# EAGLE design NAV_Doska_1 (EAGLE 7.2.0)
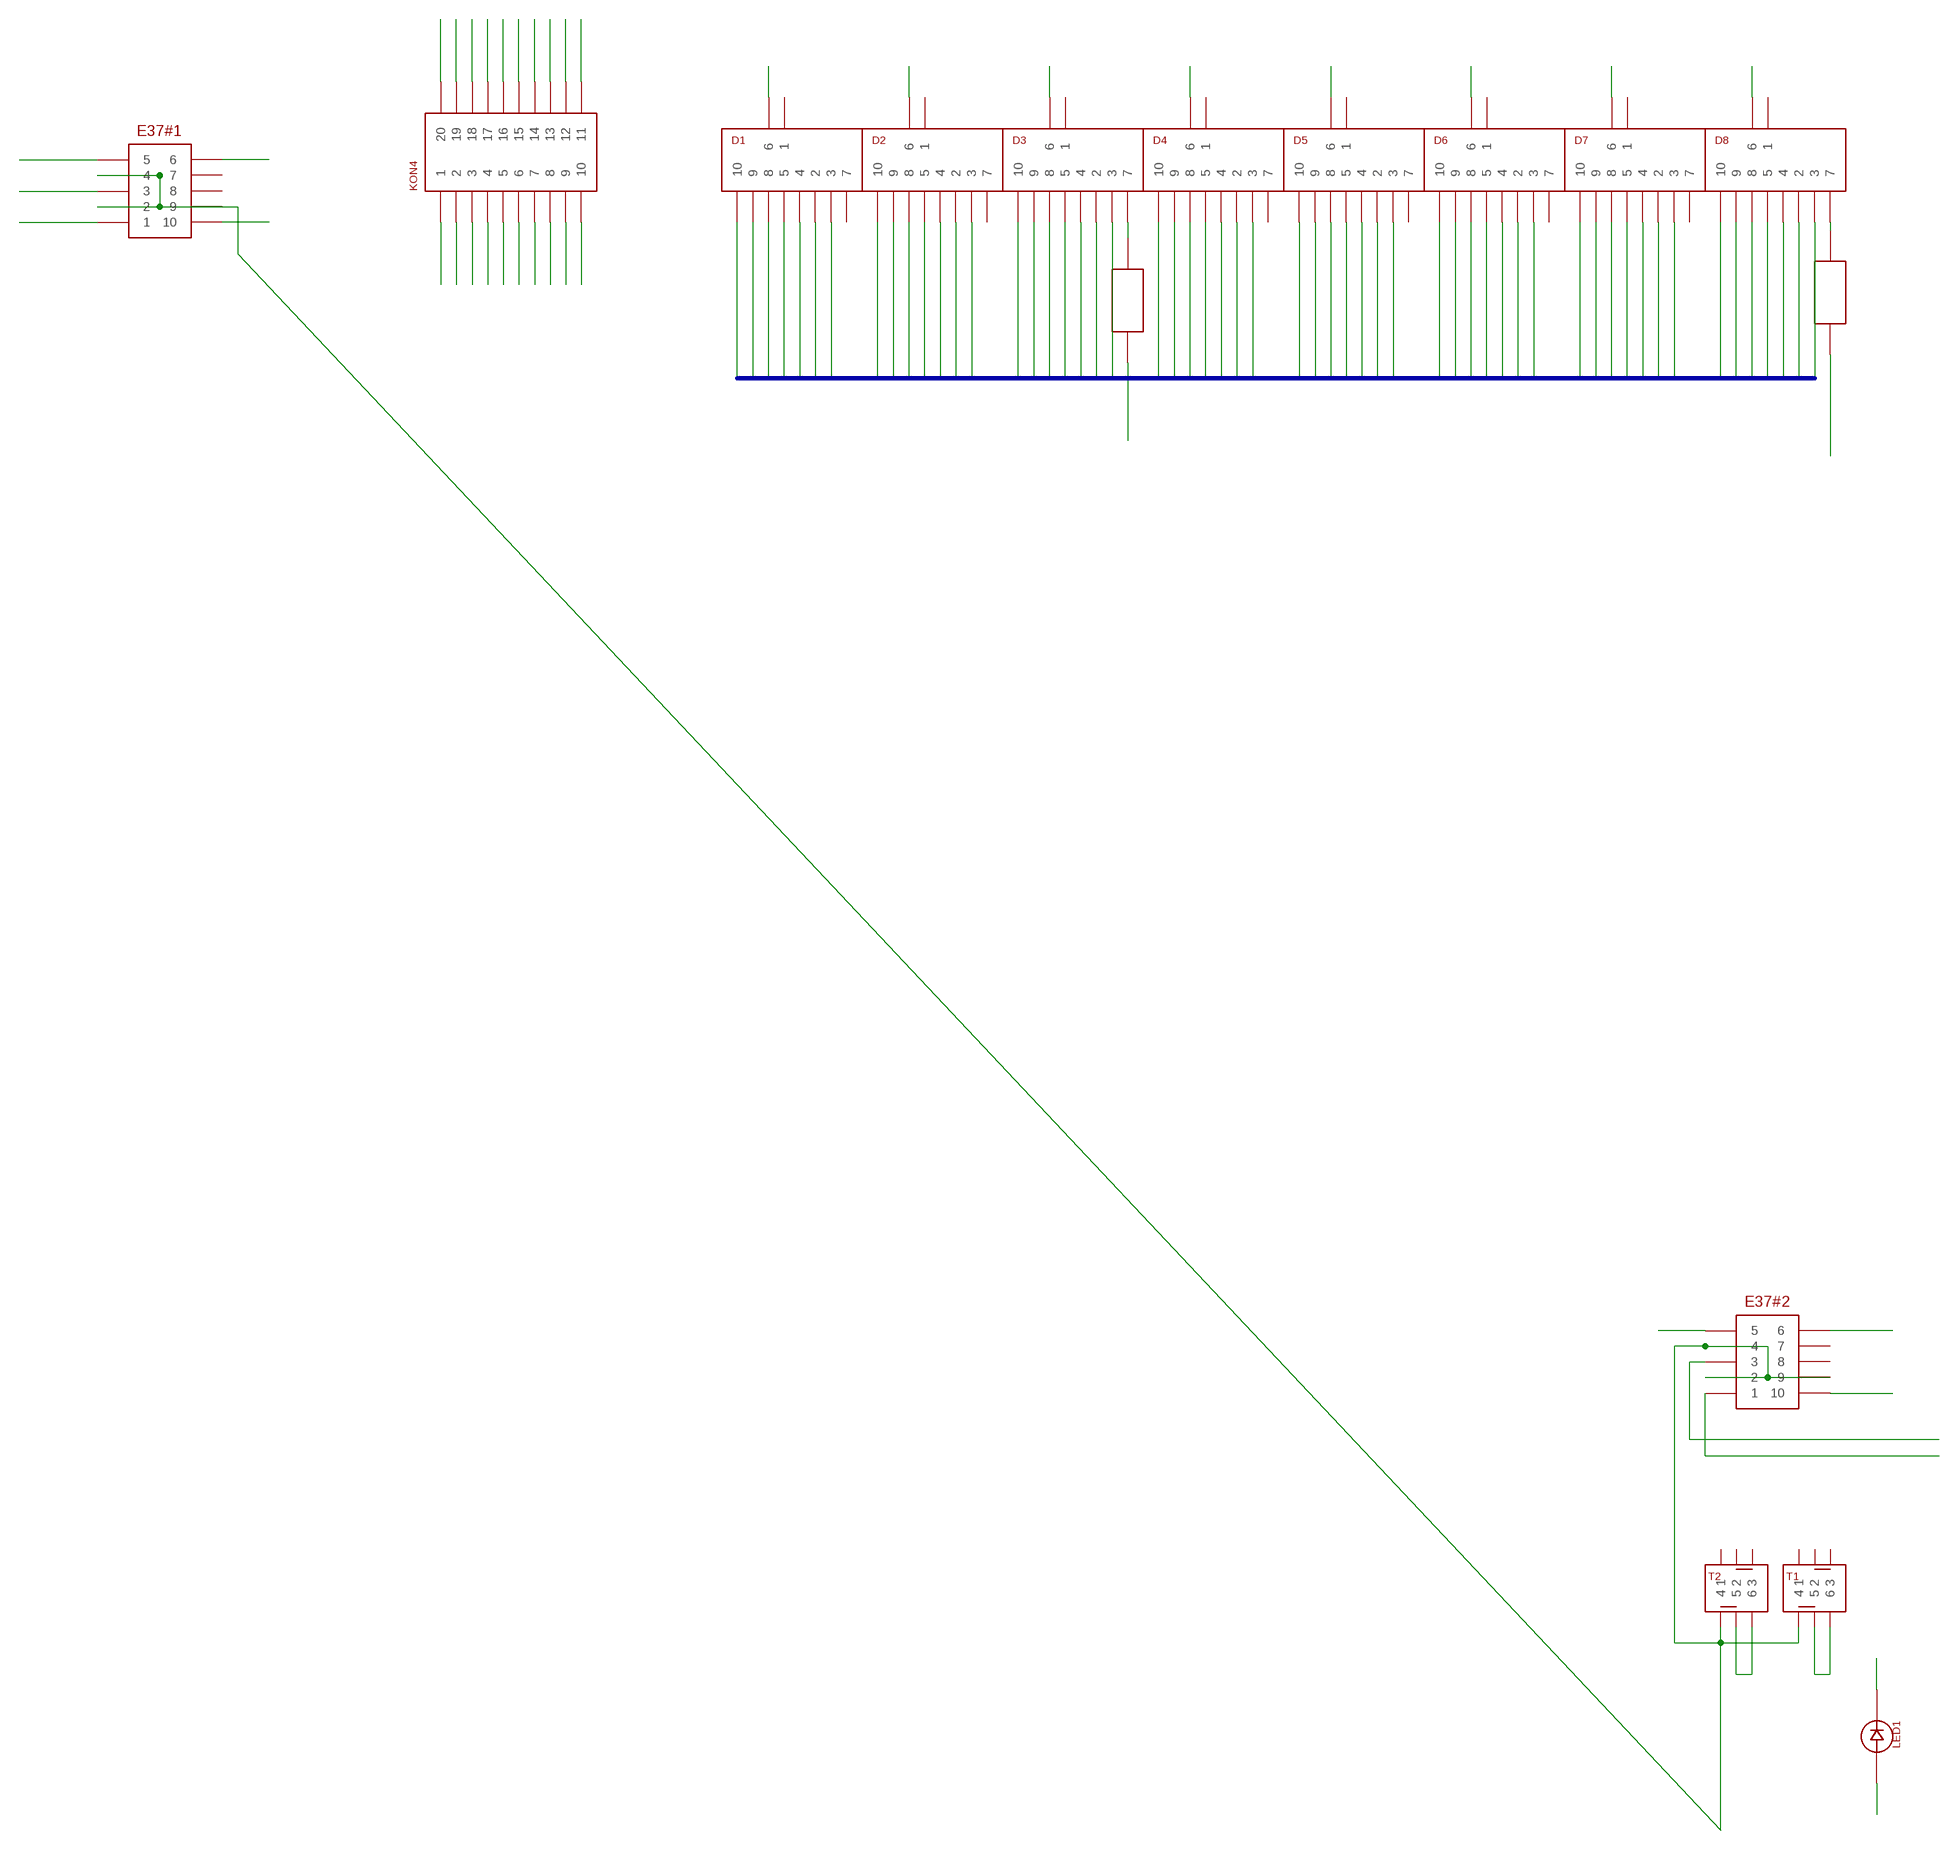
[diagram p0: schematic, sheet 1, part 1 of 2]
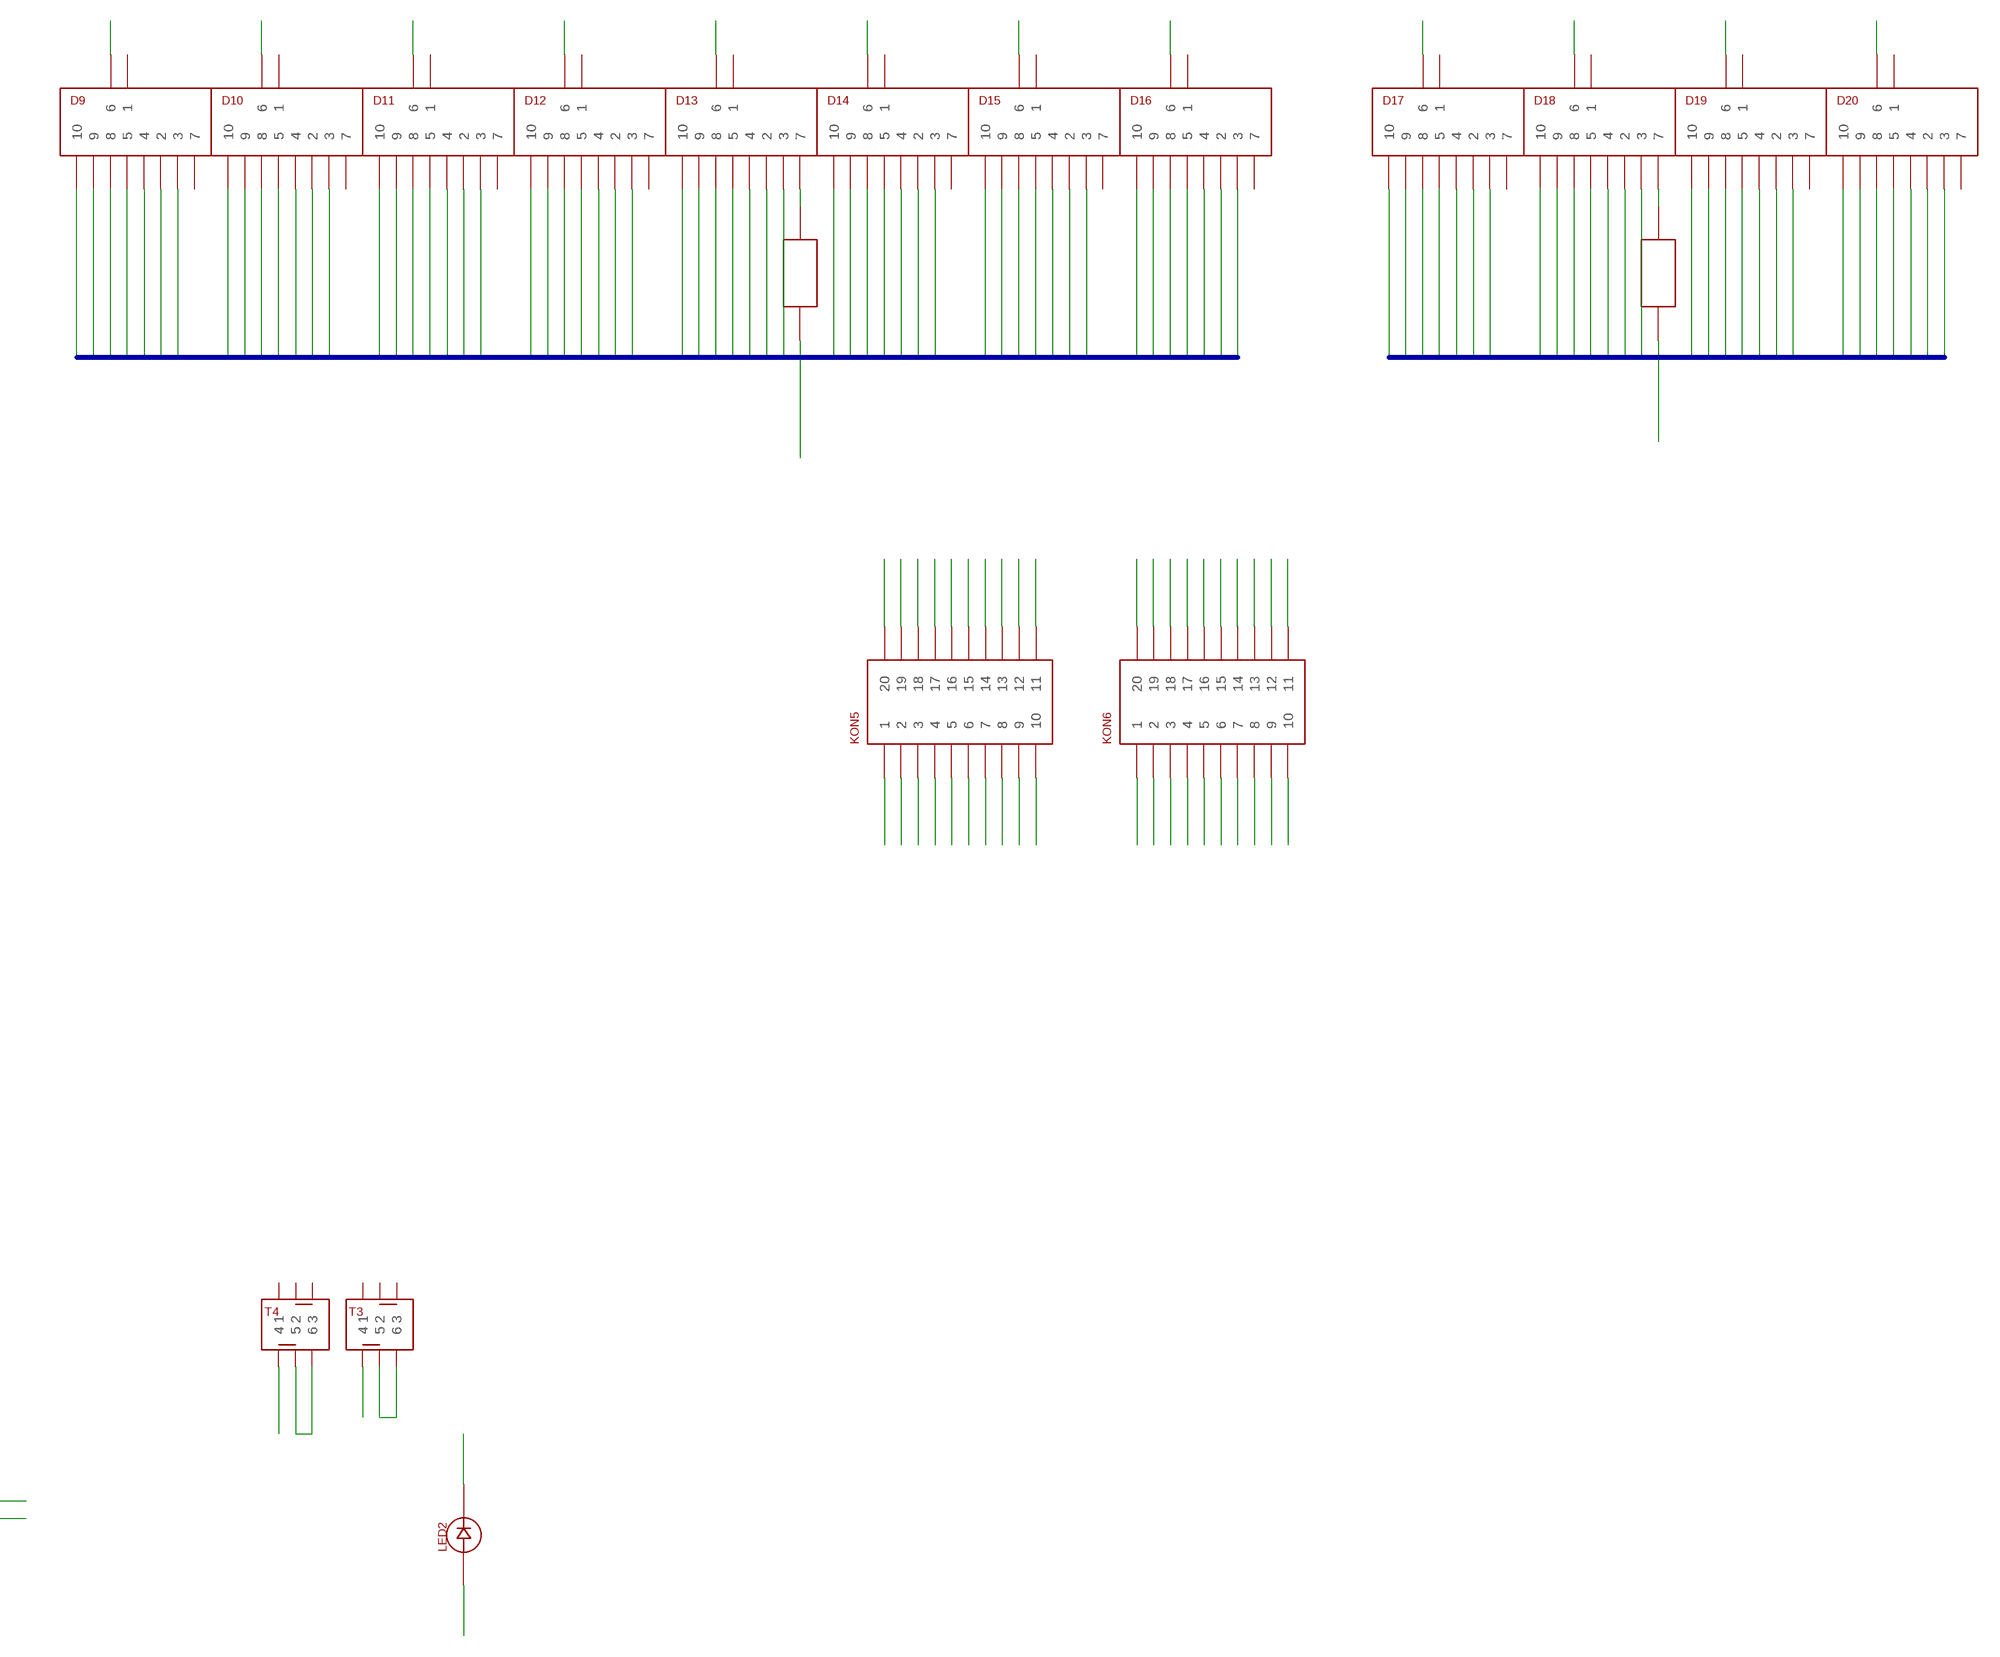
[diagram p1: schematic, sheet 1, part 2 of 2]

## Parts
D1  SA3611EWA  [SA3611EWA]
D2  SA3611EWA  [SA3611EWA]
D3  SA3611EWA  [SA3611EWA]
D4  SA3611EWA  [SA3611EWA]
D5  SA3611EWA  [SA3611EWA]
D6  SA3611EWA  [SA3611EWA]
D7  SA3611EWA  [SA3611EWA]
D8  SA3611EWA  [SA3611EWA]
D9  SA3611EWA  [SA3611EWA]
D10  SA3611EWA  [SA3611EWA]
D11  SA3611EWA  [SA3611EWA]
D12  SA3611EWA  [SA3611EWA]
D13  SA3611EWA  [SA3611EWA]
D14  SA3611EWA  [SA3611EWA]
D15  SA3611EWA  [SA3611EWA]
D16  SA3611EWA  [SA3611EWA]
D17  SA3611EWA  [SA3611EWA]
D18  SA3611EWA  [SA3611EWA]
D19  SA3611EWA  [SA3611EWA]
D20  SA3611EWA  [SA3611EWA]
E37#1  ELMA_E37  [ELMA_E37]
E37#2  ELMA_E37  [ELMA_E37]
KON4  LISTA_2X10  [LISTA_2X10]
KON5  LISTA_2X10  [LISTA_2X10]
KON6  LISTA_2X10  [LISTA_2X10]
LED1  LED_5MM  [LED_5MM]
LED2  LED_5MM  [LED_5MM]
T1  P1-0S  [P1-0S]
T2  P1-0S  [P1-0S]
T3  P1-0S  [P1-0S]
T4  P1-0S  [P1-0S]
U$1  REZISTOR  [REZISTOR]
U$2  REZISTOR  [REZISTOR]
U$3  REZISTOR  [REZISTOR]
U$4  REZISTOR  [REZISTOR]

## Nets
D1: D1.6 KON4.1
D2: D2.6 KON4.2
D3: D3.6 KON4.9
D4: D4.6 KON4.6
D5: D5.6 KON4.3
D6: D6.6 KON4.8
D7: D7.6 KON4.7
D8: D8.6 KON4.4
D9: D9.6 KON5.1
D10: D10.6 KON5.2
D11: D11.6 KON5.9
D12: D12.6 KON5.6
D13: D13.6 KON5.3
D14: D14.6 KON5.8
D15: D15.6 KON5.7
D16: D16.6 KON5.4
D17: D17.6 KON6.1
D18: D18.6 KON6.2
D19: D19.6 KON6.9
D20: D20.6 KON6.6
DRIVER1_SEG2: D1.2 D2.2 D3.2 D4.2 D5.2 D6.2 D7.2 D8.2 KON4.10
DRIVER1_SEG3: D1.3 D2.3 D3.3 D4.3 D5.3 D6.3 D7.3 D8.3 KON4.12
DRIVER1_SEG4: D1.4 D2.4 D3.4 D4.4 D5.4 D6.4 D7.4 D8.4 KON4.15
DRIVER1_SEG5: D1.5 D2.5 D3.5 D4.5 D5.5 D6.5 D7.5 D8.5 KON4.16
DRIVER1_SEG8: D1.8 D2.8 D3.8 D4.8 D5.8 D6.8 D7.8 D8.8 KON4.14
DRIVER1_SEG9: D1.9 D2.9 D3.9 D4.9 D5.9 D6.9 D7.9 D8.9 KON4.11
DRIVER1_SEG10: D1.10 D2.10 D3.10 D4.10 D5.10 D6.10 D7.10 D8.10 KON4.13
DRIVER2_SEG2: D9.2 D10.2 D11.2 D12.2 D13.2 D14.2 D15.2 D16.2 KON5.10
DRIVER2_SEG3: D9.3 D10.3 D11.3 D12.3 D13.3 D14.3 D15.3 D16.3 KON5.12
DRIVER2_SEG4: D9.4 D10.4 D11.4 D12.4 D13.4 D14.4 D15.4 D16.4 KON5.15
DRIVER2_SEG5: D9.5 D10.5 D11.5 D12.5 D13.5 D14.5 D15.5 D16.5 KON5.16
DRIVER2_SEG8: D9.8 D10.8 D11.8 D12.8 D13.8 D14.8 D15.8 D16.8 KON5.14
DRIVER2_SEG9: D9.9 D10.9 D11.9 D12.9 D13.9 D14.9 D15.9 D16.9 KON5.11
DRIVER2_SEG10: D9.10 D10.10 D11.10 D12.10 D13.10 D14.10 D15.10 D16.10 KON5.13
DRIVER3_SEG2: D17.2 D18.2 D19.2 D20.2 KON6.10
DRIVER3_SEG3: D17.3 D18.3 D19.3 D20.3 KON6.12
DRIVER3_SEG4: D17.4 D18.4 D19.4 D20.4 KON6.15
DRIVER3_SEG5: D17.5 D18.5 D19.5 D20.5 KON6.16 LED1.P$2 LED2.P$2
DRIVER3_SEG8: D17.8 D18.8 D19.8 D20.8 KON6.14
DRIVER3_SEG9: D17.9 D18.9 D19.9 D20.9 KON6.11
DRIVER3_SEG10: D17.10 D18.10 D19.10 D20.10 KON6.13
E37#1_1: E37#1.1 KON4.17
E37#1_3: E37#1.3 KON4.18
E37#1_5: E37#1.5 KON4.20
E37#1_6: E37#1.6 KON4.19
E37#1_10: E37#1.10 KON4.5
E37#2_1: E37#2.1 KON6.17
E37#2_3: E37#2.3 KON6.18
E37#2_5: E37#2.5 KON6.20
E37#2_6: E37#2.6 KON6.19
E37#2_10: E37#2.10 KON6.5
GND: E37#1.2 E37#1.4 E37#1.9 E37#2.2 E37#2.4 E37#2.9 KON5.5 T1.4 T2.4 T3.5 T3.6 T4.5 T4.6 U$1.P$1 U$2.P$1 U$3.P$1 U$4.P$1
LED1: KON6.3 LED1.P$1
LED2: KON6.8 LED2.P$1
N$2: D3.7 U$4.P$2
N$3: D18.7 U$2.P$2
N$4: D13.7 U$1.P$2
N$5: D8.7 U$3.P$2
N$33: KON6.4
N$42: KON6.7
T1: KON5.20 T1.5 T1.6
T2: KON5.19 T2.5 T2.6
T3: KON5.18 T3.4
T4: KON5.17 T4.4
Unconnected: D1.1 D1.7 D2.1 D2.7 D3.1 D4.1 D4.7 D5.1 D5.7 D6.1 D6.7 D7.1 D7.7 D8.1 D9.1 D9.7 D10.1 D10.7 D11.1 D11.7 D12.1 D12.7 D13.1 D14.1 D14.7 D15.1 D15.7 D16.1 D16.7 D17.1 D17.7 D18.1 D19.1 D19.7 D20.1 D20.7 E37#1.7 E37#1.8 E37#2.7 E37#2.8 T1.1 T1.2 T1.3 T2.1 T2.2 T2.3 T3.1 T3.2 T3.3 T4.1 T4.2 T4.3

## Buses
B$1
B$2
B$3

## Library data of the parts
D1-D20 = RadioStack_v2:SA3611EWA
E37#1 E37#2 = RadioStack_v2:ELMA_E37
KON4-KON6 = RadioStack_v2:LISTA_2X10
LED1 LED2 = RadioStack_v2:LED_5MM
T1-T4 = RadioStack_v2:P1-0S
U$1-U$4 = RadioStack_v2:REZISTOR

## Board
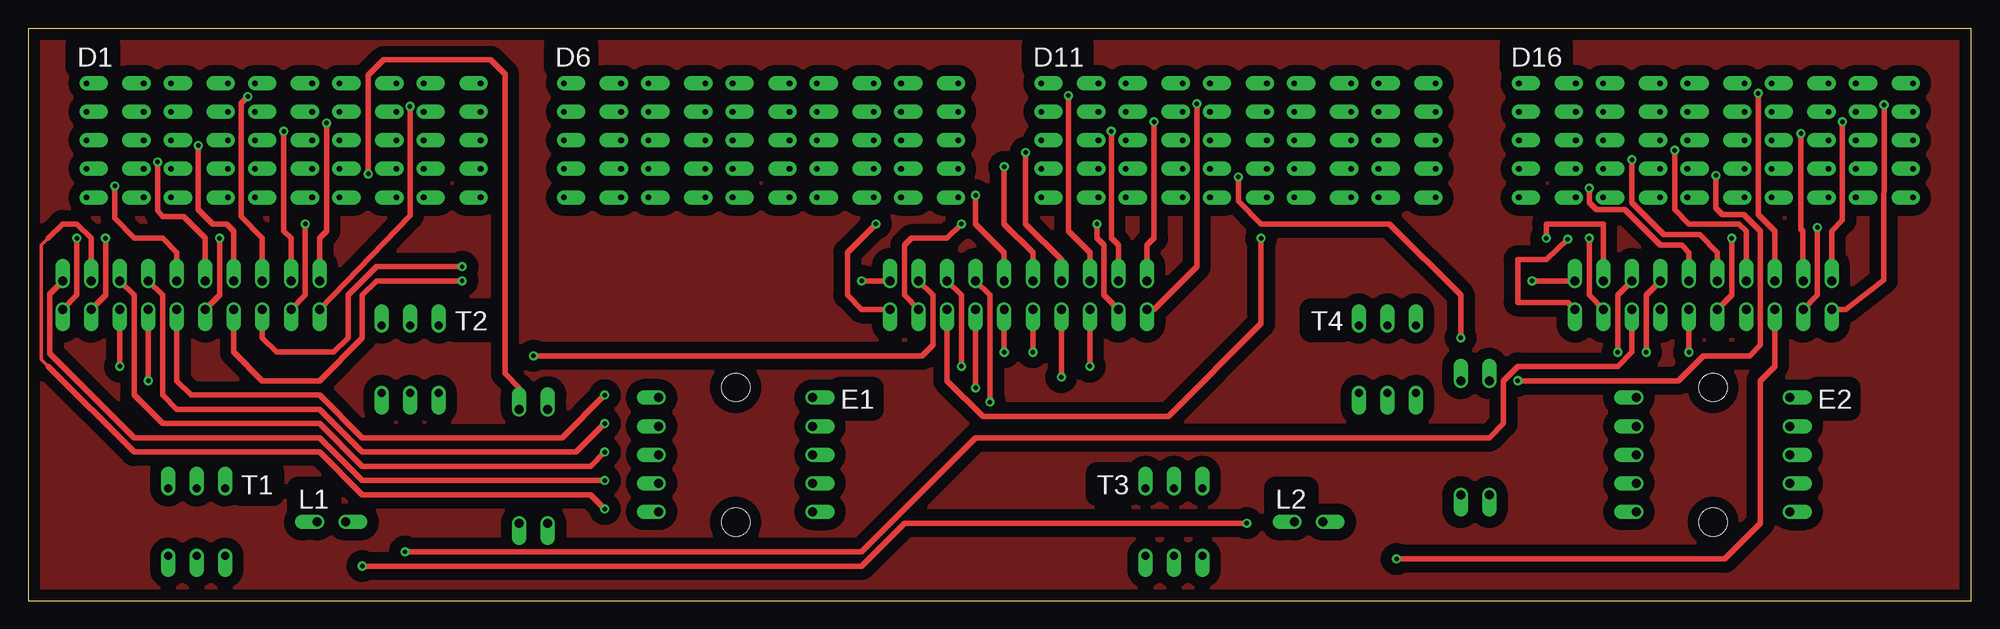
[diagram p2: board, top side]
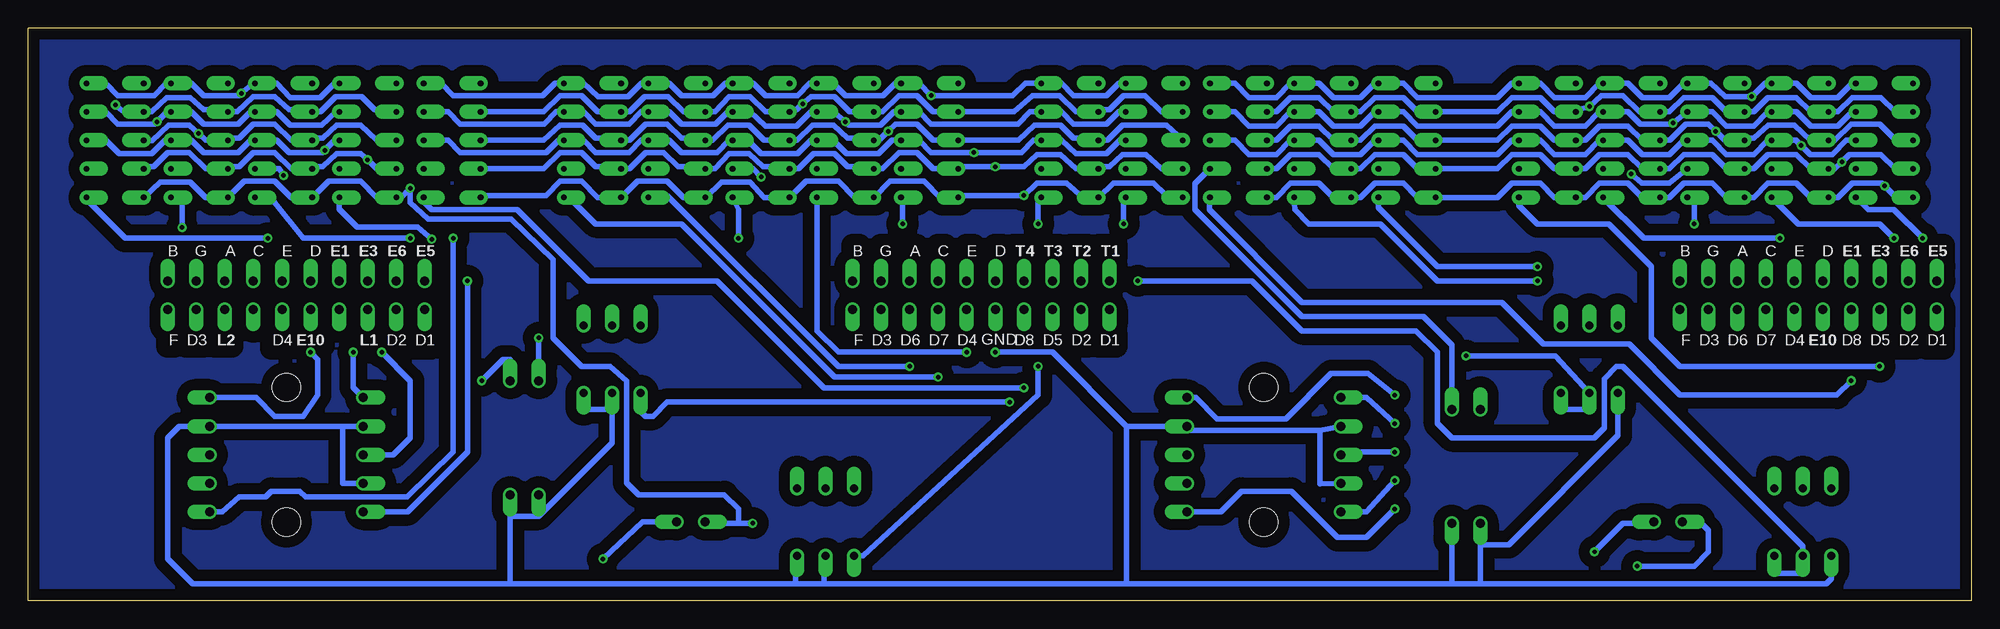
[diagram p3: board, bottom side, seen from below]

Size 173 x 51 mm. Coordinates in mm from the lower left corner, seen from the top.
Outline: 0,51 0,0 173,0 173,51 0,51
Copper layers (1*16): Top 0.035mm / dielectric 1.5mm / Bottom 0.035mm
Design rules "default *": minimum track width 0.2mm, minimum drill 0.4mm, track to track 0.2mm, track to pad 0.2mm, pad to pad 0.2mm, via to via 0.2mm, smd to smd 0.2mm, copper to edge 40mil, drill to drill 8mil, minimum pad ring 10mil, minimum via ring 8mil, stop-mask expansion 4mil, vias tented up to drill 0mil, thermal gap 10mil
tRestrict: area 19,9.4 to 21.8,11.3; area 38,24 to 40.9,25.9; area 95.2,9.4 to 98,11.3; area 114.2,24 to 117.1,25.9; area 4.3,47.5 to 7.2,49.4; area 46.9,47.5 to 49.8,49.4; area 89.4,47.5 to 93.9,49.4; area 132,47.5 to 136.5,49.4; area 24,8.2 to 26.9,10.1; area 111,8.2 to 113.9,10.1; area 72.3,17.1 to 75.2,19; area 159.3,17.1 to 162.1,19
bRestrict: area 5,22.4 to 6.6,23.7; area 7.5,22.4 to 9.1,23.7; area 10.1,22.4 to 11.7,23.7; area 12.2,22.7 to 14.8,23.7; area 15.1,22.4 to 16.7,23.7; area 2.4,22.4 to 4,23.7; area 5,30.6 to 6.6,31.7; area 7.5,30.6 to 9.1,31.7; area 10.1,30.6 to 11.7,31.7; area 12.6,30.6 to 13.3,31.7; area 15.1,30.6 to 15.8,31.7; area 2.4,30.6 to 4,31.7; 46 more areas

### Footprints (pad centres in the part's own frame; a part is rotated, then mirrored left to right if it is on the bottom)
SA3611EWA = drill 0.5 pad 1.27 offset: 1 1.21,12.08; 2 1.21,9.54; 3 1.21,7; 4 1.21,4.46; 5 1.21,1.92; 6 6.29,1.92; 7 6.29,4.46; 8 6.29,7; 9 6.29,9.54; 10 6.29,12.08
ELMA_E37 = drill 0.8 pad 1 offset: 1 -6.85,5.08; 2 -6.85,2.54; 3 -6.85,0; 4 -6.85,-2.54; 5 -6.85,-5.08; 6 6.85,-5.08; 7 6.85,-2.54; 8 6.85,0; 9 6.85,2.54; 10 6.85,5.08 | hole 2.5: 0,6; 0,-6
LISTA_2X10 = drill 0.8 pad 1.27 offset: 1 0,0; 2 0,-2.54; 3 0,-5.08; 4 0,-7.62; 5 0,-10.16; 6 0,-12.7; 7 0,-15.24; 8 0,-17.78; 9 0,-20.32; 10 0,-22.86; 11 2.54,-22.86; 12 2.54,-20.32; 13 2.54,-17.78; 14 2.54,-15.24; 15 2.54,-12.7; 16 2.54,-10.16; 17 2.54,-7.62; 18 2.54,-5.08; 19 2.54,-2.54; 20 2.54,0
LED_5MM = drill 0.8 pad 1.27 offset: P$1 1.27,0; P$2 -1.27,0
P1-0S = drill 0.7 pad 1.27 offset: 1 -2.54,3; 2 0,3; 3 2.54,3; 4 -2.54,-3; 5 0,-3; 6 2.54,-3
REZISTOR = drill 0.8 pad 1.27 offset: P$1 -5.08,0; P$2 5.08,0

### Placement (x,y rotation side)
D1  4,34 0 top
D2  11.5,34 0 top
D3  19,34 0 top
D4  26.5,34 0 top
D5  34,34 0 top
D6  46.5,34 0 top
D7  54,34 0 top
D8  61.5,34 0 top
D9  69,34 0 top
D10  76.5,34 0 top
D11  89,34 0 top
D12  96.5,34 0 top
D13  104,34 0 top
D14  111.5,34 0 top
D15  119,34 0 top
D16  131.5,34 0 top
D17  139,34 0 top
D18  146.5,34 0 top
D19  154,34 0 top
D20  161.5,34 0 top
E37#1  63,13 0 top
E37#2  150,13 0 top
KON4  3.08,25.94 90 top
KON5  76.74,25.94 90 top
KON6  137.7,25.94 90 top
LED1  27,7 0 top
LED2  114,7 0 top
T1  15,7 0 top
T2  34,21.5 0 top
T3  102,7 0 top
T4  121,21.5 0 top
U$1  127.54,14.51 90 top
U$2  130.08,14.51 90 top
U$3  46.26,11.97 90 top
U$4  43.72,11.97 90 top

### Tracks (layer width: path | path; a pad name or v marks a point on that pad's centre or on a via)
D1  (via drill 0.4 pad 0.5)
  Top 0.5: v4.35,32.29 4.35,27.21 KON4.1
  Bottom 0.5: D1.6 9.2,34.83 6.89,34.83 v4.35,32.29
D2  (via drill 0.4 pad 0.5)
  Top 0.5: v6.89,32.29 6.89,27.21 KON4.2
  Bottom 0.5: D2.6 15.43,33.56 8.16,33.56 v6.89,32.29
D3  (via drill 0.4 pad 0.5)
  Top 0.5: KON4.9 24.67,27.21 v24.67,33.56
  Bottom 0.5: D3.6 24.67,35.3 v24.67,33.56
D4  (via drill 0.4 pad 0.5)
  Top 0.5: KON4.6 17.05,27.21 v17.05,32.29
  Bottom 0.5: D4.6 29.16,32.29 v17.05,32.29
D5  (via drill 0.4 pad 0.5)
  Top 0.5: KON4.3 v8.16,20.86
  Bottom 0.5: v8.16,20.86 25.94,20.86 28.48,23.4 28.48,29.75 32.29,33.56 38.64,33.56 40.29,35.21 D5.6
D6  (via drill 0.4 pad 0.5)
  Top 0.5: KON4.8 20.86,23.4 22.13,22.13 27.21,22.13 28.48,23.4 28.48,27.21 31.02,29.75 v38.64,29.75
  Bottom 0.5: D6.6 52.79,35.01 47.53,29.75 v38.64,29.75
D7  (via drill 0.4 pad 0.5)
  Top 0.5: KON4.7 18.32,22.13 20.86,19.59 25.94,19.59 29.75,23.4 29.75,27.21 31.02,28.48 v38.64,28.48
  Bottom 0.5: v38.64,28.48 47.53,28.48 52.61,33.56 58.96,33.56 60.23,34.83 D7.6
D8  (via drill 0.4 pad 0.5)
  Top 0.5: KON4.4 v10.7,19.59
  Bottom 0.5: v10.7,19.59 11.97,18.32 25.94,18.32 30.47,22.85 38.09,22.85 41.81,26.57 59.59,26.57 67.85,34.83 67.85,35.86 D8.6
D9  (via drill 0.4 pad 0.5)
  Top 0.5: v75.47,33.56 72.93,31.02 72.93,27.21 74.2,25.94 KON5.1
  Bottom 0.5: D9.6 75.47,35.92 v75.47,33.56
D10  (via drill 0.4 pad 0.5)
  Top 0.5: v83.09,33.56 81.82,32.29 78.64,32.29 78.01,31.66 78.01,27.21 KON5.2
  Bottom 0.5: D10.6 83.09,35.62 v83.09,33.56
D11  (via drill 0.4 pad 0.5)
  Top 0.5: KON5.9 95.79,27.21 95.79,31.66 95.16,32.29 v95.16,33.56
  Bottom 0.5: D11.6 95.29,35.6 95.16,35.47 v95.16,33.56
D12  (via drill 0.4 pad 0.5)
  Top 0.5: KON5.6 v89.44,22.13
  Bottom 0.5: D12.6 102.79,35.48 102.78,35.47 102.78,24.04 100.87,22.13 v89.44,22.13
D13  (via drill 0.4 pad 0.5)
  Top 0.5: KON5.3 81.82,19.59 85,16.41 101.5,16.41 109.76,24.67 v109.76,32.29
  Bottom 0.5: 110.29,35.9 D13.6 109.76,34.83 v109.76,32.29
D14  (via drill 0.4 pad 0.5)
  Top 0.5: v94.52,20.86 KON5.8
  Bottom 0.5: D14.6 117.79,35.88 117.38,36.1 116.11,36.1 100.87,20.86 v94.52,20.86
D15  (via drill 0.4 pad 0.5)
  Top 0.5: KON5.7 v91.98,19.91
  Bottom 0.5: v91.98,19.91 101.19,19.91 114.84,33.56 122.46,33.56 125,36.1 125.11,36.1 D15.6
D16  (via drill 0.4 pad 0.5)
  Top 0.5: KON5.4 v84.36,18.95
  Bottom 0.5: D16.6 137.7,35.47 137.06,34.83 129.44,34.83 123.09,28.48 111.67,28.48 102.14,18.95 v84.36,18.95
D17  (via drill 0.4 pad 0.5)
  Top 0.5: v137.06,32.19 135.16,30.38 132.62,30.38 132.62,26.57 137.06,26.57 KON6.1
  Bottom 0.5: D17.6 145.29,34.86 143.69,33.26 138.34,33.26 v137.06,32.19
D18  (via drill 0.4 pad 0.5)
  Top 0.5: v138.97,32.29 138.97,27.21 KON6.2
  Bottom 0.5: v138.97,32.29 148.5,32.29 151.03,35.47 151.49,35.92 D18.6
D19  (via drill 0.4 pad 0.5)
  Top 0.5: v159.29,33.24 159.29,27.21 KON6.9
  Bottom 0.5: D19.6 160.29,35.73 159.29,35.47 v159.29,33.24
D20  (via drill 0.4 pad 0.5)
  Top 0.5: v151.67,32.29 151.67,27.21 KON6.6
  Bottom 0.5: D20.6 167.79,35.71 164.37,32.29 v151.67,32.29
DRIVER1_SEG2  (via drill 0.4 pad 0.5)
  Top 0.5: KON4.10 33.99,34.3 v33.99,44.02
  Bottom 0.5: D1.2 6.8,43.54 8.07,44.81 10.61,44.81 11.88,43.54 D2.2 14.3,43.54 15.57,44.81 18.11,44.81 19.38,43.54 D3.2 21.8,43.54 23.07,44.81 25.61,44.81 26.88,43.54 D4.2 29.57,43.54 31.02,44.99 32.92,44.99 v33.99,44.02 35.03,43.72 D5.2 37.12,43.54 38.39,44.81 40.93,44.81 42.2,43.54 D6.2 49.3,43.54 50.57,44.81 53.11,44.81 54.38,43.54 D7.2 56.8,43.54 58.07,44.81 60.61,44.81 61.88,43.54 D8.2 64.3,43.54
DRIVER1_SEG3  (via drill 0.4 pad 0.5)
  Top 0.5: KON4.12 23.4,32.29 22.77,32.92 v22.77,41.81
  Bottom 0.5: 64.3,41 D8.3 61.88,41 60.61,42.27 58.07,42.27 56.8,41 D7.3 54.38,41 53.11,42.27 50.57,42.27 49.3,41 D6.3 42.2,41 40.93,42.27 38.38,42.27 37.11,41 D5.3 34.38,41 33.11,42.27 30.57,42.27 29.3,41 D4.3 26.86,41 25.41,42.45 23.4,42.45 v22.77,41.81 21.95,41 D3.3 20.03,41.18 19.36,41.18 18.09,42.35 15.78,42.35 14.33,41 D2.3 12.15,41 10.7,42.45 8.16,42.45 6.89,41.18 5.39,41.18 D1.3
DRIVER1_SEG4  (via drill 0.4 pad 0.5)
  Top 0.5: KON4.15 15.78,32.29 13.88,34.2 11.97,34.2 11.54,34.73 v11.54,39.08
  Bottom 0.5: D1.4 6.8,38.46 8.07,39.73 10.88,39.73 v11.54,39.08 12.15,38.46 D2.4 14.3,38.46 15.57,39.73 18.11,39.73 19.38,38.46 D3.4 21.8,38.46 23.07,39.73 25.61,39.73 26.88,38.46 D4.4 29.3,38.46 30.57,39.73 33.11,39.73 34.38,38.46 D5.4 37.11,38.46 38.38,39.73 40.93,39.73 42.2,38.46 D6.4 49.3,38.46 50.57,39.73 53.11,39.73 54.38,38.46 D7.4 56.8,38.46 58.07,39.73 60.61,39.73 61.88,38.46 D8.4 64.3,38.46
DRIVER1_SEG5  (via drill 0.4 pad 0.5)
  Top 0.5: KON4.16 13.24,31.02 11.97,32.29 9.43,32.29 7.72,34.09 v7.72,36.94
  Bottom 0.5: 6.8,35.92 D1.5 6.71,35.92 v7.72,36.94 7.98,37.19 10.61,37.19 11.88,35.92 D2.5 14.3,35.92 15.57,37.19 18.11,37.19 19.38,35.92 D3.5 21.8,35.92 23.07,37.19 25.61,37.19 26.88,35.92 D4.5 29.3,35.92 30.57,37.19 33.11,37.19 34.38,35.92 D5.5 37.11,35.92 38.38,37.19 40.93,37.19 42.2,35.92 D6.5 49.3,35.92 50.57,37.19 53.11,37.19 54.38,35.92 D7.5 56.8,35.92 58.07,37.19 60.61,37.19 61.88,35.92 D8.5 64.3,35.92
DRIVER1_SEG8  (via drill 0.4 pad 0.5)
  Top 0.5: KON4.14 18.32,32.92 17.68,33.56 16.41,33.56 15.14,34.83 v15.14,40.55
  Bottom 0.5: 68.12,41 D8.8 65.57,41 64.3,39.73 61.89,39.73 60.62,41 D7.8 58.07,41 56.8,39.73 54.39,39.73 53.12,41 D6.8 50.57,41 49.3,39.73 42.2,39.73 40.93,41 D5.8 38.38,41 37.11,39.73 34.38,39.73 33.11,41 D4.8 30.57,41 29.3,39.73 26.89,39.73 25.62,41 D3.8 23.07,41 21.8,39.73 19.39,39.73 18.12,41 D2.8 15.57,41 15.57,40.97 v15.14,40.55 14.33,39.73 12.39,39.73 11.12,41 D1.8
DRIVER1_SEG9  (via drill 0.4 pad 0.5)
  Top 0.5: KON4.11 25.94,32.29 26.57,32.92 v26.57,42.55
  Bottom 0.5: D1.9 10.62,43.54 11.89,42.27 14.3,42.27 15.57,43.54 D2.9 18.12,43.54 19.39,42.27 21.8,42.27 23.07,43.54 D3.9 | D3.9 25.62,43.54 | 68.12,43.54 D8.9 65.57,43.54 64.3,42.27 61.89,42.27 60.62,43.54 D7.9 58.07,43.54 56.8,42.27 54.39,42.27 53.12,43.54 D6.9 50.57,43.54 49.3,42.27 42.2,42.27 40.93,43.54 D5.9 38.38,43.54 37.11,42.27 34.38,42.27 33.11,43.54 D4.9 30.57,43.54 29.48,42.45 26.68,42.45 v26.57,42.55 D3.9
DRIVER1_SEG10  (via drill 0.4 pad 0.5)
  Top 0.5: KON4.13 20.86,32.29 18.95,34.2 18.95,44.29 v19.55,44.89
  Bottom 0.5: D2.10 18.12,46.08 | 68.12,46.08 D8.10 65.57,46.08 64.3,44.81 61.89,44.81 60.62,46.08 D7.10 58.07,46.08 56.8,44.81 54.39,44.81 53.12,46.08 D6.10 50.57,46.08 49.3,44.81 42.2,44.81 40.93,46.08 D5.10 38.38,46.08 37.11,44.81 34.38,44.81 33.11,46.08 D4.10 30.57,46.08 29.3,44.81 26.89,44.81 25.62,46.08 D3.10 23.22,46.08 21.93,44.89 v19.55,44.89 18.36,46.08 D2.10 | D1.10 10.61,46.08 11.88,44.81 14.3,44.81 15.57,46.08 D2.10
DRIVER2_SEG2  (via drill 0.4 pad 0.5)
  Top 0.5: KON5.10 100.23,25.94 104.05,29.75 v104.05,44.26
  Bottom 0.5: D9.2 72.11,43.54 73.56,44.99 75.47,44.99 76.74,43.72 77.53,43.72 D10.2 79.73,43.54 81.19,44.99 83.59,44.99 85.24,43.54 D11.2 92.44,43.54 93.89,44.99 95.47,44.99 96.92,43.54 D12.2 99.86,43.54 101.2,44.89 103.29,44.89 v104.05,44.26 104.58,43.72 105.03,43.72 D13.2 107.36,43.54 108.72,44.89 110.59,44.89 111.84,43.54 D14.2 114.66,43.54 116.01,44.89 118.11,44.89 119.47,43.54 D15.2 122.28,43.54 123.73,44.99 125.64,44.99 127.09,43.54 D16.2
DRIVER2_SEG3  (via drill 0.4 pad 0.5)
  Top 0.5: KON5.12 97.06,31.66 96.42,32.29 v96.42,41.81
  Bottom 0.5: D9.3 71.66,42.35 75.57,42.35 76.92,41 D10.3 77.89,41.18 79.92,41.18 81.08,42.35 83.39,42.35 84.84,41 D11.3 92.44,41 93.89,42.45 95.79,42.45 v96.42,41.81 97.24,41 D12.3 97.89,41.18 100.03,41.18 101.31,42.35 103.17,42.35 104.53,41 D13.3 107.47,41 108.83,42.35 110.69,42.35 112.05,41 D14.3 112.89,41.18 114.84,41.18 116.11,42.45 118.02,42.45 119.47,41 D15.3 120.39,41.18 122.46,41.18 123.63,42.35 125.64,42.35 127.09,41 D16.3
DRIVER2_SEG4  (via drill 0.4 pad 0.5)
  Top 0.5: KON5.15 89.44,31.02 86.9,33.56 v86.9,38.64
  Bottom 0.5: D9.4 72.11,38.46 73.47,39.71 75.57,39.71 76.74,38.64 77.53,38.64 D10.4 79.73,38.46 81.08,39.71 83.19,39.71 84.36,38.64 v86.9,38.64 90.03,38.64 D11.4 92.44,38.46 93.89,39.91 95.47,39.91 96.92,38.46 D12.4 97.89,38.64 100.03,38.64 101.2,39.81 103.08,39.81 104.42,38.46 D13.4 105.39,38.64 107.56,38.64 108.83,39.81 110.59,39.81 111.84,38.46 D14.4 112.89,38.64 115.16,38.64 116.43,39.91 118.02,39.91 119.47,38.46 D15.4 120.39,38.64 122.46,38.64 123.73,39.91 125.64,39.91 127.09,38.46 D16.4
DRIVER2_SEG5  (via drill 0.4 pad 0.5)
  Top 0.5: KON5.16 86.9,31.02 84.36,33.56 v84.36,36.1
  Bottom 0.5: D9.5 70.39,36.1 71.66,36.1 72.83,37.17 76.36,37.17 D10.5 79.1,35.92 80.55,37.17 83.19,37.17 v84.36,36.1 90.03,36.1 D11.5 91.8,35.92 93.25,37.37 96.26,37.37 D12.5 99.42,35.92 100.87,37.37 103.76,37.37 D13.5 107.47,35.92 108.72,37.27 111.26,37.27 D14.5 114.66,35.92 116.11,37.37 118.76,37.37 D15.5 122.28,35.92 123.73,37.37 125.64,37.37 126.91,36.1 132.53,36.1 D16.5
DRIVER2_SEG8  (via drill 0.4 pad 0.5)
  Top 0.5: KON5.14 91.98,30.38 88.81,33.56 v88.81,39.91
  Bottom 0.5: D16.8 135.62,41 134.53,39.91 126.88,39.91 125.79,41 D15.8 123.55,41 122.46,39.91 119.52,39.91 118.42,41 D14.8 115.93,41 114.84,39.91 111.67,39.91 110.58,41 D13.8 108.94,41 107.75,39.81 104.48,39.81 103.29,41 D12.8 101.33,41 100.14,39.81 97.28,39.81 96.09,41 D11.8 93.7,41 92.61,39.91 v88.81,39.91 84.58,39.91 83.49,41 D10.8 81,41 79.72,39.81 76.98,39.81 75.79,41 D9.8
DRIVER2_SEG9  (via drill 0.4 pad 0.5)
  Top 0.5: KON5.11 99.6,31.66 100.23,32.29 v100.23,42.65
  Bottom 0.5: D16.9 135.62,43.54 134.53,42.45 127.08,42.45 125.99,43.54 D15.9 123.55,43.54 122.46,42.45 119.52,42.45 118.42,43.54 D14.9 115.93,43.54 114.84,42.45 111.78,42.45 110.69,43.54 D13.9 108.75,43.54 107.36,42.25 104.58,42.25 103.29,43.54 D12.9 101.33,43.54 v100.23,42.65 99.94,42.35 97.11,42.35 95.92,43.54 D11.9 93.7,43.54 92.61,42.45 84.88,42.45 83.79,43.54 D10.9 81,43.54 79.92,42.45 76.98,42.45 75.89,43.54 D9.9
DRIVER2_SEG10  (via drill 0.4 pad 0.5)
  Top 0.5: KON5.13 94.52,31.02 92.61,32.92 v92.61,44.99
  Bottom 0.5: D16.10 136.25,46.08 135.16,44.99 127.18,44.99 126.09,46.08 D15.10 123.55,46.08 122.26,44.89 119.58,44.89 118.39,46.08 D14.10 115.93,46.08 114.84,44.99 112.02,44.99 110.92,46.08 D13.10 108.44,46.08 107.36,44.99 104.52,44.99 103.42,46.08 D12.10 101.33,46.08 100.23,44.99 96.88,44.99 95.79,46.08 D11.10 93.7,46.08 v92.61,44.99 85.38,44.99 84.19,46.08 D10.10 81,46.08 79.92,44.99 76.98,44.99 75.89,46.08 D9.10
DRIVER3_SEG2  (via drill 0.4 pad 0.5)
  Top 0.5: KON6.10 161.83,25.94 165.21,28.58 v165.22,44.16
  Bottom 0.5: D17.2 140.39,43.72 142.15,43.72 143.31,44.89 145.62,44.89 146.97,43.54 D18.2 147.89,43.72 149.76,43.72 151.03,44.89 152.94,44.89 154.39,43.54 D19.2 155.39,43.72 157.38,43.72 158.56,44.79 160.66,44.79 162.01,43.54 D20.2 164.51,43.54 v165.22,44.16
DRIVER3_SEG3  (via drill 0.4 pad 0.5)
  Top 0.5: KON6.12 158,28.5 158,32.9 157.82,33.08 v157.82,41.62
  Bottom 0.5: D17.3 141.97,41 143.41,42.35 145.52,42.35 146.79,41.18 147.53,41.18 D18.3 149.59,41 151.03,42.45 152.94,42.45 154.21,41.18 155.03,41.18 D19.3 157.21,41 v157.82,41.62 158.66,42.35 160.46,42.35 161.93,40.98 162.63,40.98 D20.3
DRIVER3_SEG4  (via drill 0.4 pad 0.5)
  Top 0.5: KON6.15 150.4,31.02 148.81,32.61 145.64,32.61 142.78,35.47 v142.78,39.27
  Bottom 0.5: D17.4 141.97,38.46 v142.78,39.27 143.41,39.81 145.52,39.81 146.79,38.64 147.53,38.64 D18.4 149.59,38.46 151.03,39.91 152.94,39.91 154.21,38.64 155.03,38.64 D19.4 157.21,38.46 158.66,39.91 160.56,39.91 161.83,38.64 162.53,38.64 D20.4
DRIVER3_SEG5  (via drill 0.4 pad 0.5)
  Top 0.5: KON6.16 147.86,31.02 147.22,31.66 145.32,31.66 142.15,34.83 139.6,34.83 138.97,35.47 v138.97,36.73 | v108.49,6.89 78.01,6.89 74.2,3.08 v29.75,3.08
  Bottom 0.5: D20.5 161.26,37.27 158.56,37.27 157.21,35.92 D19.5 153.76,37.37 151.03,37.37 149.59,35.92 D18.5 146.26,37.37 143.41,37.37 141.97,35.92 D17.5 139.78,35.92 v138.97,36.73 138.97,35.47 137.4,33.99 129.98,33.99 126.27,30.38 126.27,23.4 123.73,20.86 121.19,20.86 119.7,19.59 119.7,10.48 118.65,9.43 111.03,9.43 109.76,8.16 109.76,6.89 | 109.76,6.89 112.62,6.89 LED2.P$2 | v108.49,6.89 109.76,6.89 | LED1.P$2 25.41,7 25.3,6.89 24.04,6.89 23.4,6.26 23.4,4.35 24.67,3.08 v29.75,3.08
DRIVER3_SEG8  (via drill 0.4 pad 0.5)
  Top 0.5: KON6.14 152.94,32.92 152.31,33.56 147.86,33.56 146.59,34.83 v146.59,40.11
  Bottom 0.5: D20.8 166.09,41 164.91,39.81 161.98,39.81 160.79,41 D19.8 158.47,41 157.38,39.91 154.28,39.91 153.19,41 D18.8 150.85,41 149.76,39.91 146.79,39.91 v146.59,40.11 145.7,41 D17.8
DRIVER3_SEG9  (via drill 0.4 pad 0.5)
  Top 0.5: KON6.11 160.56,32.92 161.51,33.88 v161.51,42.65
  Bottom 0.5: D20.9 166.09,43.54 165,42.45 161.71,42.45 v161.51,42.65 160.62,43.54 D19.9 158.47,43.54 157.38,42.45 154.28,42.45 153.19,43.54 D18.9 150.85,43.54 149.66,42.35 146.88,42.35 145.59,43.54 D17.9
DRIVER3_SEG10  (via drill 0.4 pad 0.5)
  Top 0.5: KON6.13 155.48,32.92 154.01,34.4 v154.01,45.19
  Bottom 0.5: D20.10 166.09,46.08 165,44.99 161.78,44.99 160.69,46.08 D19.10 158.47,46.08 157.38,44.99 154.21,44.99 v154.01,45.19 152.92,46.08 D18.10 150.85,46.08 149.66,44.79 146.98,44.79 145.69,46.08 D17.10
E37#1_1  (via drill 0.4 pad 0.5)
  Top 0.5: KON4.17 11.97,27.21 11.97,18.32 13.24,17.05 25.94,17.05 29.75,13.24 48.8,13.24 v51.34,15.78
  Bottom 0.5: E37#1.1 53.88,18.08 v51.34,15.78
E37#1_3  (via drill 0.4 pad 0.5)
  Top 0.5: KON4.18 9.43,27.21 9.43,18.32 11.97,15.78 25.94,15.78 29.75,11.97 50.07,11.97 v51.34,13.24 v51.35,13.25
  Bottom 0.5: v51.34,13.24 55.9,13.25 E37#1.3
E37#1_5  (via drill 0.4 pad 0.5)
  Top 0.5: KON4.20 1.91,27.31 1.91,22.03 9.43,14.51 25.94,14.51 29.75,10.7 v51.34,10.7
  Bottom 0.5: E37#1.5 53.88,7.92 v51.34,10.7
E37#1_6  (via drill 0.4 pad 0.5)
  Top 0.3: 1.81,32.29 1.17,31.66 1.17,21.5 1.81,20.86
  Top 0.5: v51.34,8.16 50.07,9.43 29.75,9.43 25.94,13.24 9.43,13.24 1.81,20.86 | KON4.19 5.62,32.29 4.35,33.56 3.08,33.56 1.81,32.29
  Bottom 0.5: v51.34,8.16 53.88,5.62 56.42,5.62 60.55,9.75 64.99,9.75 66.82,7.92 E37#1.6
E37#1_10  (via drill 0.4 pad 0.5)
  Top 0.5: KON4.5 13.24,19.59 14.51,18.32 25.94,18.32 29.75,14.51 47.53,14.51 v51.34,18.32
  Bottom 0.5: v51.34,18.32 53.72,20.23 57,20.23 61.03,16.2 67.15,16.2 69.03,18.08 E37#1.10
E37#2_1  (via drill 0.4 pad 0.5)
  Top 0.5: KON6.17 144.05,27.21 v144.05,22.13
  Bottom 0.5: v144.05,22.13 144.05,18.98 E37#2.1
E37#2_3  (via drill 0.4 pad 0.5)
  Top 0.5: KON6.18 141.51,27.21 v141.51,22.13
  Bottom 0.5: v141.51,22.13 138.97,19.59 138.97,14.51 140.48,13 E37#2.3
E37#2_5  (via drill 0.4 pad 0.5)
  Top 0.5: KON6.20 v133.89,28.48
  Bottom 0.5: E37#2.5 139.21,7.92 133.89,13.24 v133.89,28.48
E37#2_6  (via drill 0.4 pad 0.5)
  Top 0.5: KON6.19 140.24,33.56 135.16,33.56 v135.16,32.29
  Bottom 0.5: E37#2.6 155.72,7.92 154.21,9.23 151.87,9.23 151.35,9.75 148.81,9.75 148.29,9.23 139.27,9.23 135.16,13.24 v135.16,32.29
E37#2_10  (via drill 0.4 pad 0.5)
  Top 0.5: v147.86,22.13 KON6.5
  Bottom 0.5: v147.86,22.13 147.22,21.5 147.22,18.32 148.5,16.41 151.03,16.41 152.7,18.08 E37#2.10
GND  (via drill 0.4 pad 0.5)
  Top 0.5: KON5.5 v86.9,22.13
  Bottom 0.5: E37#2.4 145,10.46 145,15.54 | E37#1.4 58.01,10.38 58.01,15.14 | 58.01,15.14 69.44,15.14 69.83,15.54 E37#1.9 75.23,15.54 | E37#1.2 58.01,15.14 | 102.14,1.49 75.23,1.49 | 75.23,1.49 46.26,1.49 | 46.26,1.49 43.72,1.49 | 43.72,1.49 12.92,1.49 12.46,1.96 T1.4 | 145,15.54 E37#2.9 159.53,15.54 160.56,14.51 160.56,3.71 158.34,1.49 130.08,1.49 | 145,15.54 E37#2.2 | 102.14,1.49 104.68,1.49 | 104.68,1.49 130.08,1.49 | U$4.P$1 43.72,4.99 | 43.72,4.99 43.72,1.49 | U$3.P$1 46.26,1.49 | 102.14,3.08 102.14,2.87 | 102.14,2.87 102.14,1.49 | T3.5 102.14,2.87 | T4.5 121,17.05 | 130.08,1.49 U$2.P$1 130.08,7.53 127.54,7.53 | 121,17.05 121,14.07 127.54,7.53 | 127.54,7.53 U$1.P$1 | T2.4 31.46,14.7 41.18,4.99 43.72,4.99 | v86.9,22.13 81.82,22.13 75.23,15.54 | 75.23,15.54 75.23,1.49 | T3.6 104.68,4 104.68,1.49 | T4.6 123.54,17.05 121,17.05
LED1  (via drill 0.4 pad 0.5)
  Top 0.5: KON6.3 142.78,22.13 141.51,20.86 132.62,20.86 131.35,19.59 131.35,15.78 130.08,14.51 84.36,14.51 74.2,4.35 v33.56,4.35
  Bottom 0.5: v33.56,4.35 31.02,6.89 28.38,6.89 LED1.P$1
LED2  (via drill 0.4 pad 0.5)
  Top 0.5: v121.83,3.71 151.03,3.71 154.21,6.89 154.21,19.59 155.48,20.86 KON6.8
  Bottom 0.5: v121.83,3.71 118.28,7 LED2.P$1
N$1
  pour Top (isolate 1): 0.22,50.7 0.22,0.22 172.62,0.22 172.62,50.7
N$2  (via drill 0.4 pad 0.5)
  Top 0.5: v30.28,38.01 30.28,46.8 31.66,48.16 41.18,48.16 42.45,46.9 42.45,20.23 43.72,18.95 U$4.P$2
  Bottom 0.5: D3.7 26.91,37.17 29.35,37.17 v30.28,38.01
N$3  (via drill 0.4 pad 0.5)
  Top 0.5: v150.25,37.86 150.25,34.98 150.84,34.4 152.74,34.4 154.21,32.92 154.21,22.77 153.26,21.81 149.15,21.81 146.93,19.59 v132.62,19.59
  Bottom 0.5: D18.7 150.65,38.46 v150.25,37.86 | U$2.P$2 130.08,21.5 130.72,21.5 v132.62,19.59
N$4  (via drill 0.4 pad 0.5)
  Top 0.5: v107.74,37.74 107.74,35.58 109.76,33.56 121.19,33.56 127.54,27.21 v127.54,23.4
  Bottom 0.5: v127.54,23.4 U$1.P$2 | D13.7 108.46,38.46 v107.74,37.74
N$5
  Bottom 0.5: D8.7 69.12,37.13 69.12,34.83 59.59,25.3 48.8,25.3 46.26,22.77 U$3.P$2
N$6
  pour Bottom (isolate 1): 0,51 0,0 173,0 173,51
T1  (via drill 0.4 pad 0.5)
  Top 0.5: v74.2,28.48 KON5.20
  Bottom 0.5: v74.2,28.48 64.04,28.48 59.59,24.04 49.44,24.04 47.53,22.13 47.53,15.78 46.26,14.51 33.56,14.51 32.69,15.38 32.69,19.76 31.59,20.86 31.02,20.86 15,4.84 T1.5 15,2.45 17.54,2.45 T1.6
T2  (via drill 0.4 pad 0.5)
  Top 0.5: KON5.19 80.55,27.21 80.55,22.77 79.6,21.81 v44.99,21.81
  Bottom 0.5: v44.99,21.81 37.05,21.81 T2.5 34,17.05 36.54,17.05 T2.6
T3  (via drill 0.4 pad 0.5)
  Top 0.5: KON5.18 83.09,27.21 v83.09,20.86
  Bottom 0.5: v83.09,20.86 83.09,18.32 98.68,4 T3.4
T4  (via drill 0.4 pad 0.5)
  Top 0.5: KON5.17 85.63,27.21 v85.63,17.68
  Bottom 0.5: T4.4 118.46,16.86 118.02,16.41 117.38,16.41 116.11,17.68 v85.63,17.68

### Text on the board
tPlace: D1 | D6 | D11 | D16 | T2 | T4 | E1 | E2 | T1 | T3 | L1 | L2
bPlace: E5 | E6 | E3 | E1 | D | E | C | A | G | B | T1 | T2 | T3 | T4 | D | E | C | A | G | B | E5 | E6 | E3 | E1 | D | E | C | A | G | B | D1 | D2 | D5 | D8 | E10 | D4 | D7 | D6 | D3 | F | D1 | D2 | D5 | D8 | D4 | D7 | D6 | D3 | F | D1 | D2 | L1 | E10 | D4 | L2 | D3 | F | GND